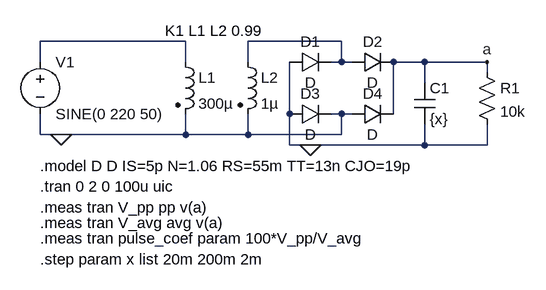
[diagram p0: schematic 2.5.asc]
2.5.asc, the LTspice schematic file:
Version 4
SHEET 1 1076 680
WIRE 320 80 96 80
WIRE 560 80 416 80
WIRE 96 112 96 80
WIRE 320 112 320 80
WIRE 416 112 416 80
WIRE 560 112 560 80
WIRE 560 112 544 112
WIRE 576 112 560 112
WIRE 688 112 640 112
WIRE 784 112 688 112
WIRE 784 128 784 112
WIRE 688 144 688 112
WIRE 480 192 480 112
WIRE 560 192 544 192
WIRE 576 192 560 192
WIRE 640 192 640 112
WIRE 96 224 96 192
WIRE 128 224 96 224
WIRE 320 224 320 192
WIRE 320 224 128 224
WIRE 416 224 416 192
WIRE 416 224 320 224
WIRE 560 224 560 192
WIRE 560 224 416 224
WIRE 480 240 480 192
WIRE 512 240 480 240
WIRE 688 240 688 208
WIRE 688 240 512 240
WIRE 784 240 784 208
WIRE 784 240 688 240
FLAG 128 224 0
FLAG 784 112 a
FLAG 512 240 0
SYMBOL voltage 96 96 R0
WINDOW 123 0 0 Left 0
WINDOW 39 0 0 Left 0
SYMATTR InstName V1
SYMATTR Value SINE(0 220 50)
SYMBOL ind2 304 96 R0
SYMATTR InstName L1
SYMATTR Value 300µ
SYMATTR SpiceLine Rser=10m
SYMATTR Type ind
SYMBOL ind2 400 96 R0
SYMATTR InstName L2
SYMATTR Value 1µ
SYMATTR SpiceLine Rser=10m
SYMATTR Type ind
SYMBOL cap 672 144 R0
SYMATTR InstName C1
SYMATTR Value {x}
SYMBOL res 768 112 R0
SYMATTR InstName R1
SYMATTR Value 10k
SYMBOL diode 480 128 R270
WINDOW 0 32 32 VTop 2
WINDOW 3 0 32 VBottom 2
SYMATTR InstName D1
SYMBOL diode 576 128 R270
WINDOW 0 32 32 VTop 2
WINDOW 3 0 32 VBottom 2
SYMATTR InstName D2
SYMBOL diode 480 208 R270
WINDOW 0 32 32 VTop 2
WINDOW 3 0 32 VBottom 2
SYMATTR InstName D3
SYMBOL diode 576 208 R270
WINDOW 0 32 32 VTop 2
WINDOW 3 0 32 VBottom 2
SYMATTR InstName D4
TEXT 96 272 Left 2 !.model D D IS=5p N=1.06 RS=55m TT=13n CJO=19p
TEXT 288 64 Left 2 !K1 L1 L2 0.99
TEXT 96 304 Left 2 !.tran 0 2 0 100u uic
TEXT 96 336 Left 2 !.meas tran V_pp pp v(a)
TEXT 96 360 Left 2 !.meas tran V_avg avg v(a)
TEXT 96 384 Left 2 !.meas tran pulse_coef param 100*V_pp/V_avg
TEXT 96 416 Left 2 !.step param x list 20m 200m 2m

The netlist it stands for:
* 2.5.asc
V1 N001 0 SINE(0 220 50)
L1 N001 0 300µ Rser=10m
L2 N002 0 1µ Rser=10m
C1 a 0 {x}
R1 a 0 10k
D1 0 N002 D
D2 N002 a D
D3 0 0 D
D4 0 a D
.model D D
.lib standard.dio
.model D D IS=5p N=1.06 RS=55m TT=13n CJO=19p
K1 L1 L2 0.99
.tran 0 2 0 100u uic
.meas tran V_pp pp v(a)
.meas tran V_avg avg v(a)
.meas tran pulse_coef param 100*V_pp/V_avg
.step param x list 20m 200m 2m
.backanno
.end

* Results of the author's LTspice run, read from the files saved beside the schematic
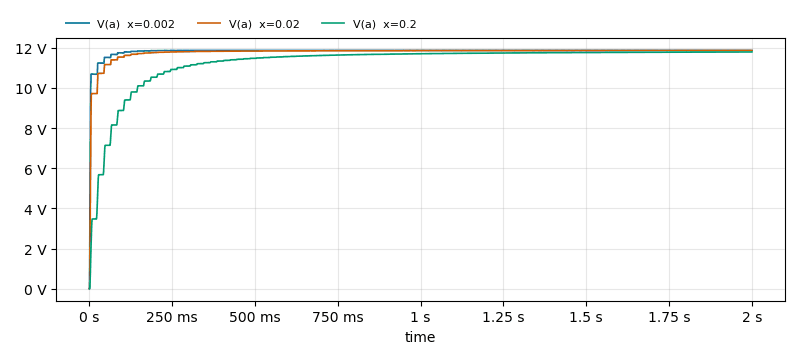
[diagram p1: Transient Analysis of 2.5.asc, plotted from the saved traces]
* Transient Analysis, 3 runs:
*   V(a) [x=0.002]: min 0 V, max 11.87 V, average 11.82 V, rms 11.83 V, last 11.86 V
*   V(a) [x=0.02]: min 0 V, max 11.86 V, average 11.77 V, rms 11.78 V, last 11.86 V
*   V(a) [x=0.2]: min 0 V, max 11.79 V, average 11.27 V, rms 11.35 V, last 11.79 V
* From the log:
*   Measurement: v_pp
*     step  PP(v(a))  FROM  TO
*        1  11.8676  0  2
*        2  11.8616  0  2
*        3  11.7873  0  2
*   Measurement: v_avg
*     step  AVG(v(a))  FROM  TO
*        1  11.8221  0  2
*        2  11.7744  0  2
*        3  11.2698  0  2
*   Measurement: pulse_coef
*     step  100*v_pp/v_avg
*        1  100.385
*        2  100.741
*        3  104.592